# Altium schematic sheet STC12C5A60S2底板.SchDoc
size A3
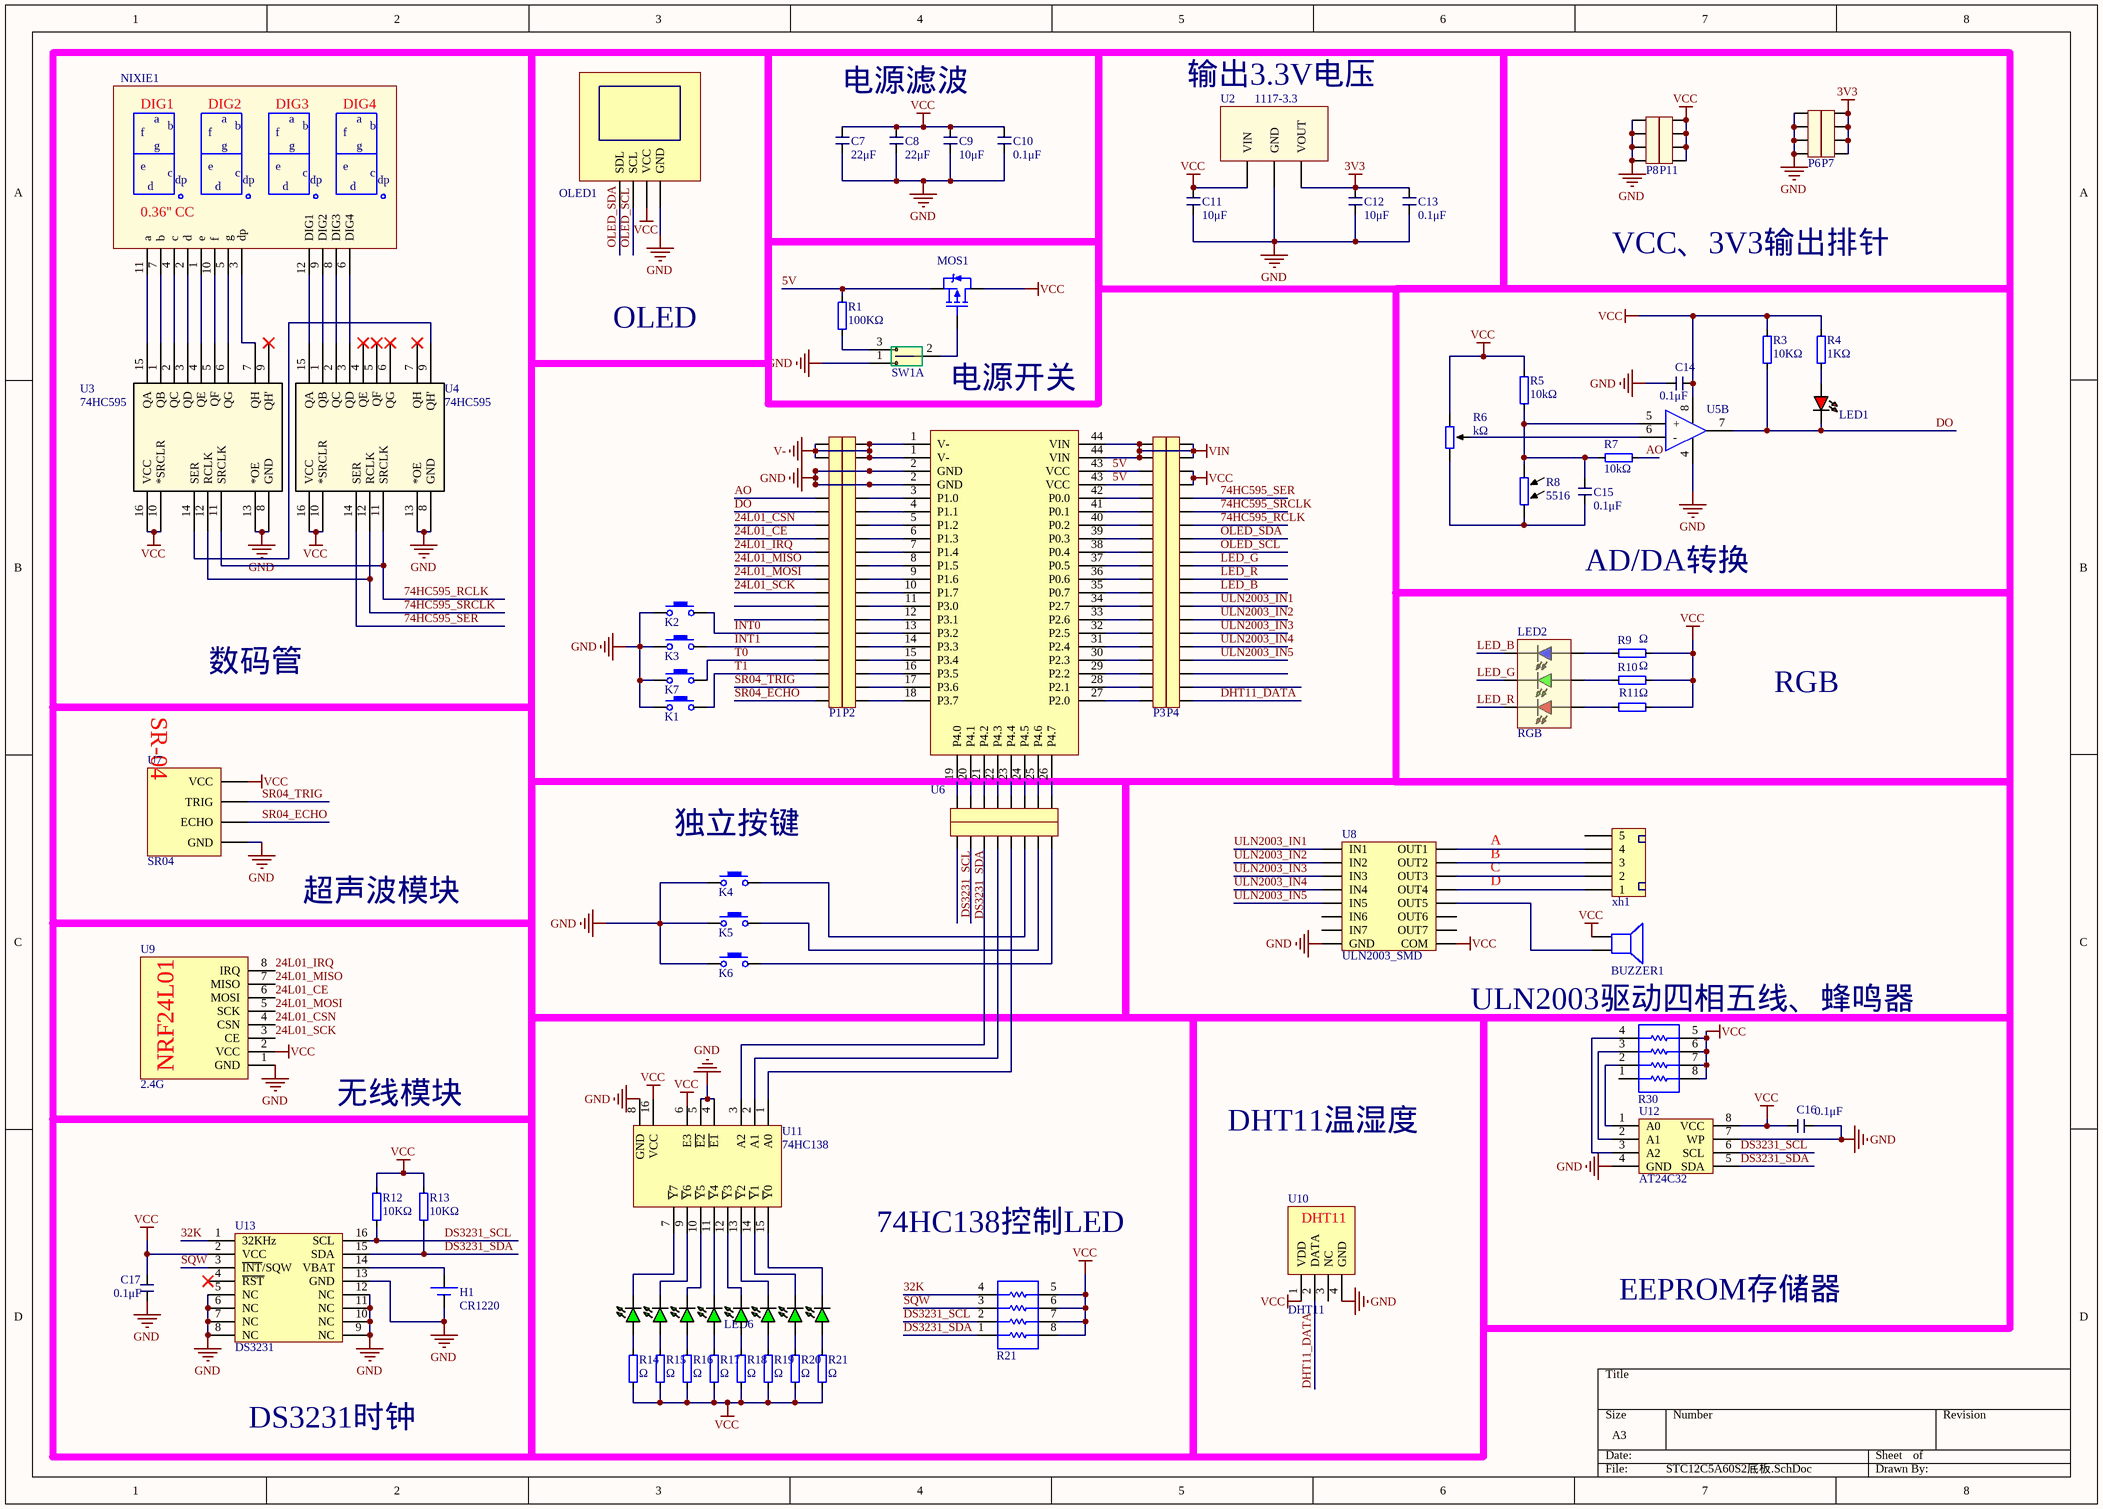
[diagram p0: STC12C5A60S2底板.SchDoc]

## Parts
(Parts that share a designator on the sheet are numbered #1, #2 ... from top to bottom, then left to right.)
?#1  R30  [排阻(0603)]
?#2  R21  [排阻(0603)]
BUZZER1  BUZZER 9.6X5.5_4MM  [BUZZER9.6x4_4mm]  (value not drawn)
C7  22μF  [C_0805]
C8  22μF  [C_0805]
C9  10μF  [C_0805]
C10  0.1μF  [C_0805]
C11  10μF  [C_0805]
C12  10μF  [C_0805]
C13  0.1μF  [C_0805]
C14  0.1μF  [C_0805]
C15  0.1μF  [C_0805]
C16  0.1μF  [C_0805]
C17  0.1μF  [C_0805]
H1  CR1220  [holder_CR1220_SMD]
K1  TACT SWITCH_4_DIP  [TACT SWITCH_4_DIP]  (value not drawn)
K2  TACT SWITCH_4_DIP  [TACT SWITCH_4_DIP]  (value not drawn)
K3  TACT SWITCH_4_DIP  [TACT SWITCH_4_DIP]  (value not drawn)
K4  TACT SWITCH_4_DIP  [TACT SWITCH_4_DIP]  (value not drawn)
K5  TACT SWITCH_4_DIP  [TACT SWITCH_4_DIP]  (value not drawn)
K6  TACT SWITCH_4_DIP  [TACT SWITCH_4_DIP]  (value not drawn)
K7  TACT SWITCH_4_DIP  [TACT SWITCH_4_DIP]  (value not drawn)
LED1  LED_0603-R  [LED_0603-R]  (value not drawn)
LED2  RGB  [LED 5050_RGB]
LED3  LED_0603-G  [LED_0603-G]  (value not drawn)
LED4  LED_0603-G  [LED_0603-G]  (value not drawn)
LED5  LED_0603-G  [LED_0603-G]  (value not drawn)
LED6  LED_0603-G  [LED_0603-G]  (value not drawn)
LED7  LED_0603-G  [LED_0603-G]  (value not drawn)
LED8  LED_0603-G  [LED_0603-G]  (value not drawn)
LED9  LED_0603-G  [LED_0603-G]  (value not drawn)
LED10  LED_0603-G  [LED_0603-G]  (value not drawn)
MOS1  SI2301  [SOT_23_3]  (value not drawn)
NIXIE1  Nixie Tube_CC(0.36in)_4  [Nixie Tube_4(0.36in)]  (value not drawn)
OLED1  0.96''  [OLED 0.96'']  (value not drawn)
P1  PIN20  [PIN_20]  (value not drawn)
P2  PIN20  [PIN_20]  (value not drawn)
P3  PIN20  [PIN_20]  (value not drawn)
P4  PIN20  [PIN_20]  (value not drawn)
P6  PIN4  [PIN_4]  (value not drawn)
P7  PIN4  [PIN_4]  (value not drawn)
P8  PIN4  [PIN_4]  (value not drawn)
P11  PIN4  [PIN_4]  (value not drawn)
P12  PIN8  [PIN_8]  (value not drawn)
P13  PIN8  [PIN_8]  (value not drawn)
R1  100KΩ  [R_0805]
R3  10KΩ  [R_0805]
R4  1KΩ  [R_0805]
R5  10kΩ  [R_0805]
R6  kΩ  [RP_3362P]
R7  10kΩ  [R_0805]
R8  5516  [GM55-55XX]
R9  Ω  [R_0805]
R10  Ω  [R_0805]
R11  Ω  [R_0805]
R12  10KΩ  [R_0805]
R13  10KΩ  [R_0805]
R14  Ω  [R_0805]
R15  Ω  [R_0805]
R16  Ω  [R_0805]
R17  Ω  [R_0805]
R18  Ω  [R_0805]
R19  Ω  [R_0805]
R20  Ω  [R_0805]
R21  Ω  [R_0805]
SW1  switchi_slide(SMD)  [switchi_slide(SMD)]  (value not drawn)  (part A of 2)
U2  1117-3.3  [SOT_223]
U3  74HC595  [SOP_16]
U4  74HC595  [SOP_16]
U5  LM393_DIP  [SOP_8]  (value not drawn)  (part B of 2)
U6  socket  [STC12_moudle]  (value not drawn)
U7  SR04  [SR04]
U8  ULN2003_SMD  [SOP_16]
U9  2.4G  [NRF24L01]
U10  DHT11  [DHT11]
U11  74HC138  [SOP_16]
U12  AT24C32  [SOP_8]
U13  DS3231  [SOP_16]
xh1  XH2.54_5  [XH2.54_5]  (value not drawn)

## Blocks framed on the sheet
数码管: NIXIE1 U3 U4
OLED: OLED1
电源滤波: C7-C10
输出3.3V电压: C11-C13 U2
VCC、3V3输出排针: P6-P8 P11
电源开关: MOS1 R1 SW1
AD/DA转换: C14 C15 LED1 R3-R8 U5
超声波模块: U7
独立按键: K4-K6 P12 P13
ULN2003驱动四相五线、蜂鸣器: BUZZER1 U8 xh1
74HC138控制LED: ?#2 LED3-LED10 R14-R21 U11
EEPROM存储器: ?#1 C16 U12

## Nets
3V3: C12.1 C13.1 P7.1 P7.2 P7.3 P7.4 U2.2(VOUT)
GND: C7.2 C8.2 C9.2 C10.2 C11.2 C12.2 C13.2 C14.1 C16.2 C17.2 H1.2(-) K1.1 K2.1 K3.1 K4.1 K5.1 K6.1 K7.1 OLED1.1(GND) P1.17 P1.18 P2.17 P2.18 P6.1 P6.2 P6.3 P6.4 P8.1 P8.2 P8.3 P8.4 SW1.1 U2.1(GND) U3.8(GND) U3.13(*OE) U4.8(GND) U4.13(*OE) U5.4(GND) U6.2(GND) U7.4(GND) U8.8(GND) U9.1(GND) U10.4(GND) U11.4(~{E1}) U11.5(~{E2}) U11.8(GND) U12.4(GND) U12.7(WP) U13.5(NC) U13.6(NC) U13.7(NC) U13.8(NC) U13.9(NC) U13.10(NC) U13.11(NC) U13.12(NC) U13.13(GND)
V-: P1.19 P1.20 P2.19 P2.20 U6.1(V-)
VCC: ?#1.5 ?#1.6 ?#1.7 ?#1.8 ?#2.5 ?#2.6 ?#2.7 ?#2.8 BUZZER1.1(+) C7.1 C8.1 C9.1 C10.1 C11.1 C14.2 C16.1 C17.1 MOS1.3(D) OLED1.2(VCC) P4.17 P4.18 P11.1 P11.2 P11.3 P11.4 R3.2 R4.2 R5.1 R6.1 R9.2 R10.2 R11.2 R12.2 R13.2 R14.1 R15.1 R16.1 R17.1 R18.1 R19.1 R20.1 R21.1 U2.3(VIN) U3.10(*SRCLR) U3.16(VCC) U4.10(*SRCLR) U4.16(VCC) U5.8(VCC) U7.1(VCC) U8.9(COM) U9.2(VCC) U10.1(VDD) U11.16(VCC) U12.8(VCC) U13.2(VCC)
VIN: P3.19 P3.20 P4.19 P4.20 U6.44(VIN)
5V: MOS1.2(S) P3.17 P3.18 R1.2 U6.43(VCC)
24L01_CE: P1.13 U9.6(MOSI)
24L01_CSN: P1.14 U9.4(CSN)
24L01_IRQ: P1.12 U9.8(IRQ)
24L01_MISO: P1.11 U9.7(MISO)
24L01_MOSI: P1.10 U9.5(SCK)
24L01_SCK: P1.9 U9.3(CE)
32K: ?#2.4 U13.1(32KHz)
74HC595_RCLK: P4.14 U3.11(SRCLK) U4.11(SRCLK)
74HC595_SER: P4.16 U4.14(SER)
74HC595_SRCLK: P4.15 U3.12(RCLK) U4.12(RCLK)
AO: P1.16 R7.2
DHT11_DATA: P4.1 U10.2(DATA)
DO: LED1.2 P1.15 R3.1 U5.7
DS3231_SCL: ?#2.2 P13.1 R12.1 U12.6(SCL) U13.16(SCL)
DS3231_SDA: ?#2.1 P13.2 R13.1 U12.5(SDA) U13.15(SDA)
INT0: K2.2 P1.6
INT1: K3.2 P1.5
LED_B: LED2.1 P4.9
LED_G: LED2.5 P4.11
LED_R: LED2.3 P4.10
OLED_SCL: OLED1.3(SCL) P4.12
OLED_SDA: OLED1.4(SDL) P4.13
SQW: ?#2.3 U13.3(~{INT}/SQW)
SR04_ECHO: P1.1 U7.3(ECHO)
SR04_TRIG: P1.2 U7.2(TRIG)
T0: K7.2 P1.4
T1: K1.2 P1.3
ULN2003_IN1: P4.8 U8.1(IN1)
ULN2003_IN2: P4.7 U8.2(IN2)
ULN2003_IN3: P4.6 U8.3(IN3)
ULN2003_IN4: P4.5 U8.4(IN4)
ULN2003_IN5: P4.4 U8.5(IN5)
Net?#1_2: ?#1.2 U12.1(A0)
Net?#1_3: ?#1.3 U12.2(A1)
Net?#1_4: ?#1.4 U12.3(A2)
NetBUZZER1_2: BUZZER1.2 U8.12(OUT5)
NetC15_1: C15.1 R5.2 R7.1 R8.1 U5.5(+)
NetC15_2: C15.2 R6.3 R8.2
NetH1_1: H1.1(+) U13.14(VBAT)
NetK4_2: K4.2 P13.6
NetK5_2: K5.2 P13.7
NetK6_2: K6.2 P13.8
NetLED1_1: LED1.1 R4.1
NetLED2_2: LED2.2 R9.1
NetLED2_4: LED2.4 R11.1
NetLED2_6: LED2.6 R10.1
NetLED3_1: LED3.1 R14.2
NetLED3_2: LED3.2 U11.7(~{Y}7)
NetLED4_1: LED4.1 R15.2
NetLED4_2: LED4.2 U11.9(~{Y}6)
NetLED5_1: LED5.1 R16.2
NetLED5_2: LED5.2 U11.10(~{Y}5)
NetLED6_1: LED6.1 R17.2
NetLED6_2: LED6.2 U11.11(~{Y}4)
NetLED7_1: LED7.1 R18.2
NetLED7_2: LED7.2 U11.12(~{Y}3)
NetLED8_1: LED8.1 R19.2
NetLED8_2: LED8.2 U11.13(~{Y}2)
NetLED9_1: LED9.1 R20.2
NetLED9_2: LED9.2 U11.14(~{Y}1)
NetLED10_1: LED10.1 R21.2
NetLED10_2: LED10.2 U11.15(~{Y}0)
NetMOS1_1: MOS1.1(G) SW1.2
NetNIXIE1_1: NIXIE1.1(e) U3.4(QE)
NetNIXIE1_2: NIXIE1.2(d) U3.3(QD)
NetNIXIE1_3: NIXIE1.3(dp) U3.7(QH)
NetNIXIE1_4: NIXIE1.4(c) U3.2(QC)
NetNIXIE1_5: NIXIE1.5(g) U3.6(QG)
NetNIXIE1_6: NIXIE1.6(DIG4) U4.3(QD)
NetNIXIE1_7: NIXIE1.7(b) U3.1(QB)
NetNIXIE1_8: NIXIE1.8(DIG3) U4.2(QC)
NetNIXIE1_9: NIXIE1.9(DIG2) U4.1(QB)
NetNIXIE1_10: NIXIE1.10(f) U3.5(QF)
NetNIXIE1_11: NIXIE1.11(a) U3.15(QA)
NetNIXIE1_12: NIXIE1.12(DIG1) U4.15(QA)
NetP2_1: P2.1 U6.18(P3.7)
NetP2_2: P2.2 U6.17(P3.6)
NetP2_3: P2.3 U6.16(P3.5)
NetP2_4: P2.4 U6.15(P3.4)
NetP2_5: P2.5 U6.14(P3.3)
NetP2_6: P2.6 U6.13(P3.2)
NetP2_7: P2.7 U6.12(P3.1)
NetP2_8: P2.8 U6.11(P3.0)
NetP2_9: P2.9 U6.10(P1.7)
NetP2_10: P2.10 U6.9(P1.6)
NetP2_11: P2.11 U6.8(P1.5)
NetP2_12: P2.12 U6.7(P1.4)
NetP2_13: P2.13 U6.6(P1.3)
NetP2_14: P2.14 U6.5(P1.2)
NetP2_15: P2.15 U6.4(P1.1)
NetP2_16: P2.16 U6.3(P1.0)
NetP3_1: P3.1 U6.27(P2.0)
NetP3_2: P3.2 U6.28(P2.1)
NetP3_3: P3.3 U6.29(P2.2)
NetP3_4: P3.4 U6.30(P2.3)
NetP3_5: P3.5 U6.31(P2.4)
NetP3_6: P3.6 U6.32(P2.5)
NetP3_7: P3.7 U6.33(P2.6)
NetP3_8: P3.8 U6.34(P2.7)
NetP3_9: P3.9 U6.35(P0.7)
NetP3_10: P3.10 U6.36(P0.6)
NetP3_11: P3.11 U6.37(P0.5)
NetP3_12: P3.12 U6.38(P0.4)
NetP3_13: P3.13 U6.39(P0.3)
NetP3_14: P3.14 U6.40(P0.2)
NetP3_15: P3.15 U6.41(P0.1)
NetP3_16: P3.16 U6.42(P0.0)
NetP12_1: P12.1 U6.19(P4.0)
NetP12_2: P12.2 U6.20(P4.1)
NetP12_3: P12.3 U6.21(P4.2)
NetP12_4: P12.4 U6.22(P4.3)
NetP12_5: P12.5 U6.23(P4.4)
NetP12_6: P12.6 U6.24(P4.5)
NetP12_7: P12.7 U6.25(P4.6)
NetP12_8: P12.8 U6.26(P4.7)
NetP13_3: P13.3 U11.3(A2)
NetP13_4: P13.4 U11.2(A1)
NetP13_5: P13.5 U11.1(A0)
NetR1_1: R1.1 SW1.3
NetR6_2: R6.2 U5.6(-)
NetU3_14: U3.14(SER) U4.9(QH')
NetU8_13: U8.13(OUT4) xh1.1
NetU8_14: U8.14(OUT3) xh1.2
NetU8_15: U8.15(OUT2) xh1.3
NetU8_16: U8.16(OUT1) xh1.4

Not connected (* = marked no-connect by the designer): ?#1 1; P1 7 8; P4 2 3; U3 9(QH')*; U4 4(QE)* 5(QF)* 6(QG)* 7(QH)*; U8 6(IN6) 7(IN7) 10(OUT7) 11(OUT6); U10 3(NC); U11 6(E3); U13 4(~{RST})*; xh1 5

## Notes on the sheet
- RGB
- B
- A
- C
- D
- 无线模块
- DHT11温湿度
- DS3231时钟
- Labels drawn without touching a wire or pin: VCC
- (in symbol Nixie Tube_CC(0.36in)_4) 0.36'' CC
- (in symbol SR04) SR-04

## Library data of the parts
?#1 ?#2 = 排阻(0603)
C7-C17 = C_0805
H1 = holder_CR1220_SMD
LED2 = LED_5050_RGB
OLED1 = OLED 0.96''_module
R1 R3-R5 R7 R9-R21 = R_0805
R6 = RP_3362P
R8 = GM55-55XX
U2 = AMS1117-3.3
U6 = STC12C_module
U9 = NRF24L01
U13 = DS3231_SOP16